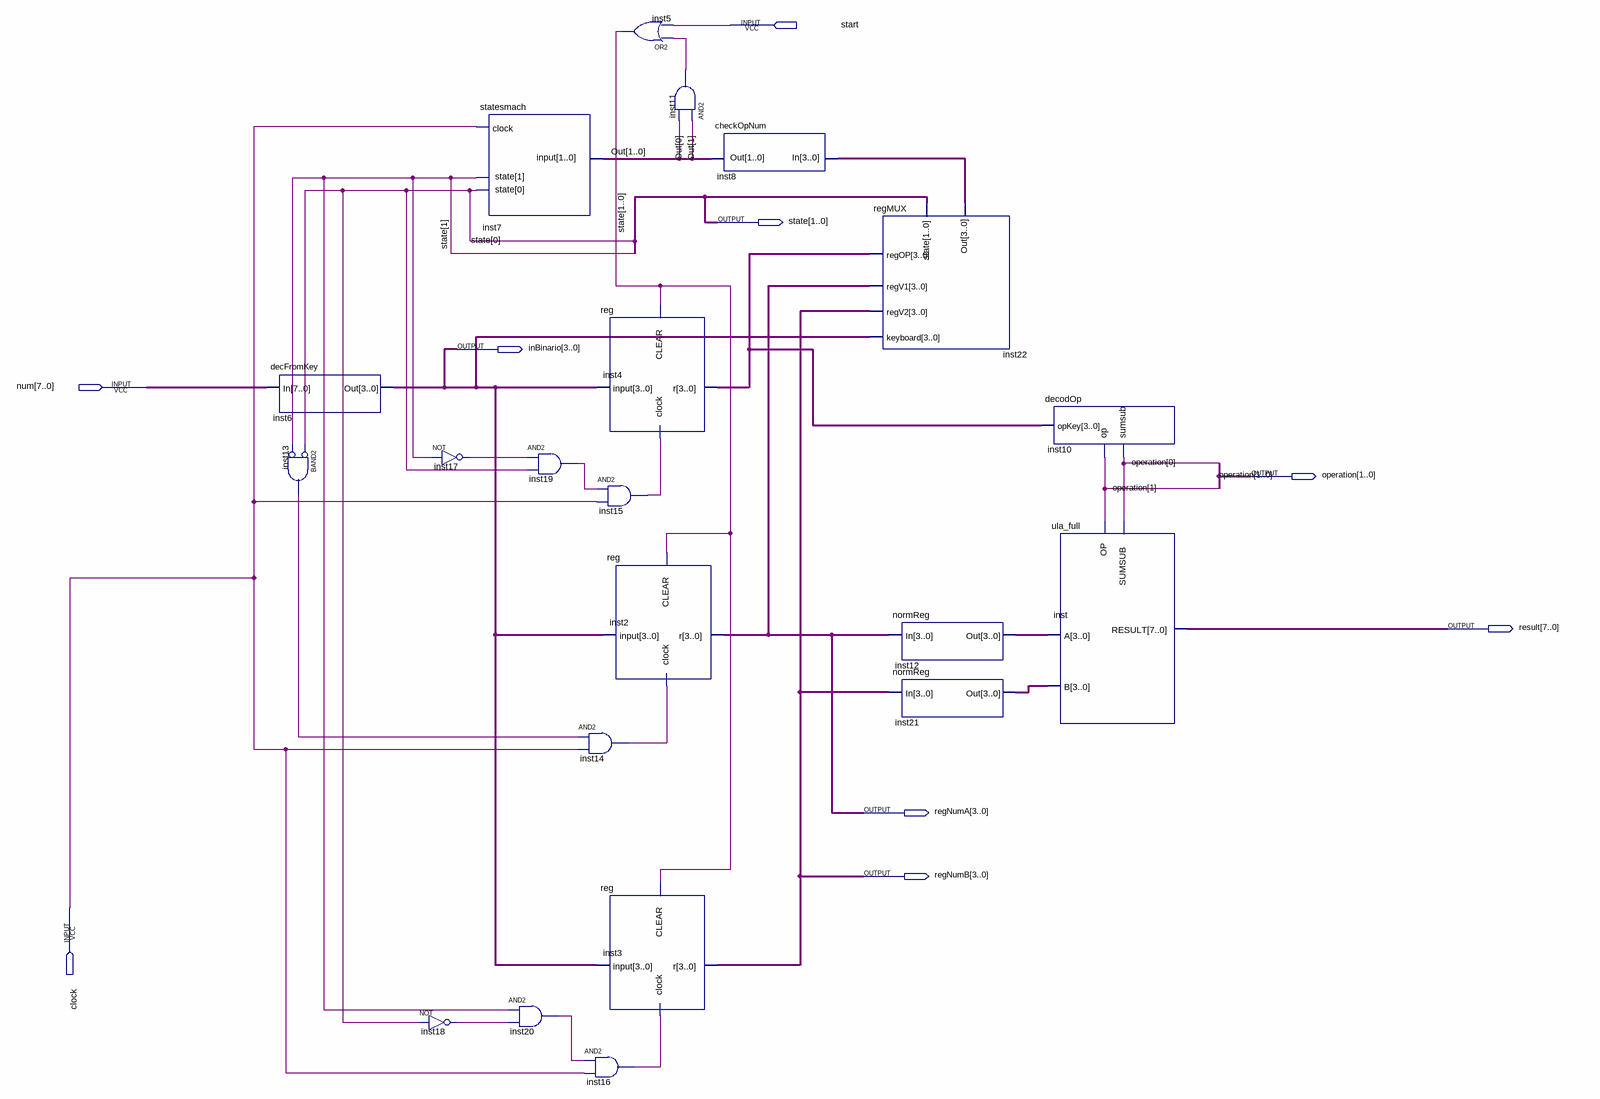
[diagram p0: schematic sheet]
// Quartus schematic calcTest.bdf as structural Verilog: 21 symbols, 9 pins
module calcTest (
  input  start,
  input  [7:0] num,
  input  clock,
  output [1:0] state,
  output [3:0] inBinario,
  output [1:0] operation,
  output [7:0] result,
  output [3:0] regNumA,
  output [3:0] regNumB
);

  wire inst5_out, inst11_out, inst13_out, inst14_out, inst15_out, inst16_out, inst17_out, inst18_out,
       inst19_out, inst20_out;
  wire [1:0] Out;
  wire [3:0] inst4_r, inst12_out, inst21_out, inst22_out;

  decFromKey inst6 (.In(num), .Out(inBinario));
  and inst13 (inst13_out, ~state[0], ~state[1]);  // BAND2
  not inst17 (inst17_out, state[1]);
  not inst18 (inst18_out, state[0]);
  statesmach inst7 (.\input (Out), .clock(clock), .state(state));
  and inst19 (inst19_out, inst17_out, state[0]);
  and inst20 (inst20_out, state[1], inst18_out);
  and inst14 (inst14_out, inst13_out, clock);
  and inst16 (inst16_out, inst20_out, clock);
  or inst5 (inst5_out, inst11_out, start);
  \reg  inst4 (.CLEAR(inst5_out), .\input (inBinario), .clock(inst15_out), .r(inst4_r));
  and inst15 (inst15_out, inst19_out, clock);
  \reg  inst2 (.CLEAR(inst5_out), .\input (inBinario), .clock(inst14_out), .r(regNumA));
  \reg  inst3 (.CLEAR(inst5_out), .\input (inBinario), .clock(inst16_out), .r(regNumB));
  and inst11 (inst11_out, Out[1], Out[0]);
  checkOpNum inst8 (.In(inst22_out), .Out(Out));
  regMUX inst22 (
    .state(state), .regV1(regNumA), .regV2(regNumB), .regOP(inst4_r), .keyboard(inBinario), .Out(inst22_out));
  normReg inst12 (.In(regNumA), .Out(inst12_out));
  normReg inst21 (.In(regNumB), .Out(inst21_out));
  decodOp inst10 (.opKey(inst4_r), .sumsub(operation[0]), .op(operation[1]));
  ula_full inst (.OP(operation[1]), .A(inst12_out), .B(inst21_out), .SUMSUB(operation[0]), .RESULT(result));
endmodule
